# Altium schematic sheet SmartBriefBox.schdoc
size 218 x 139 mm
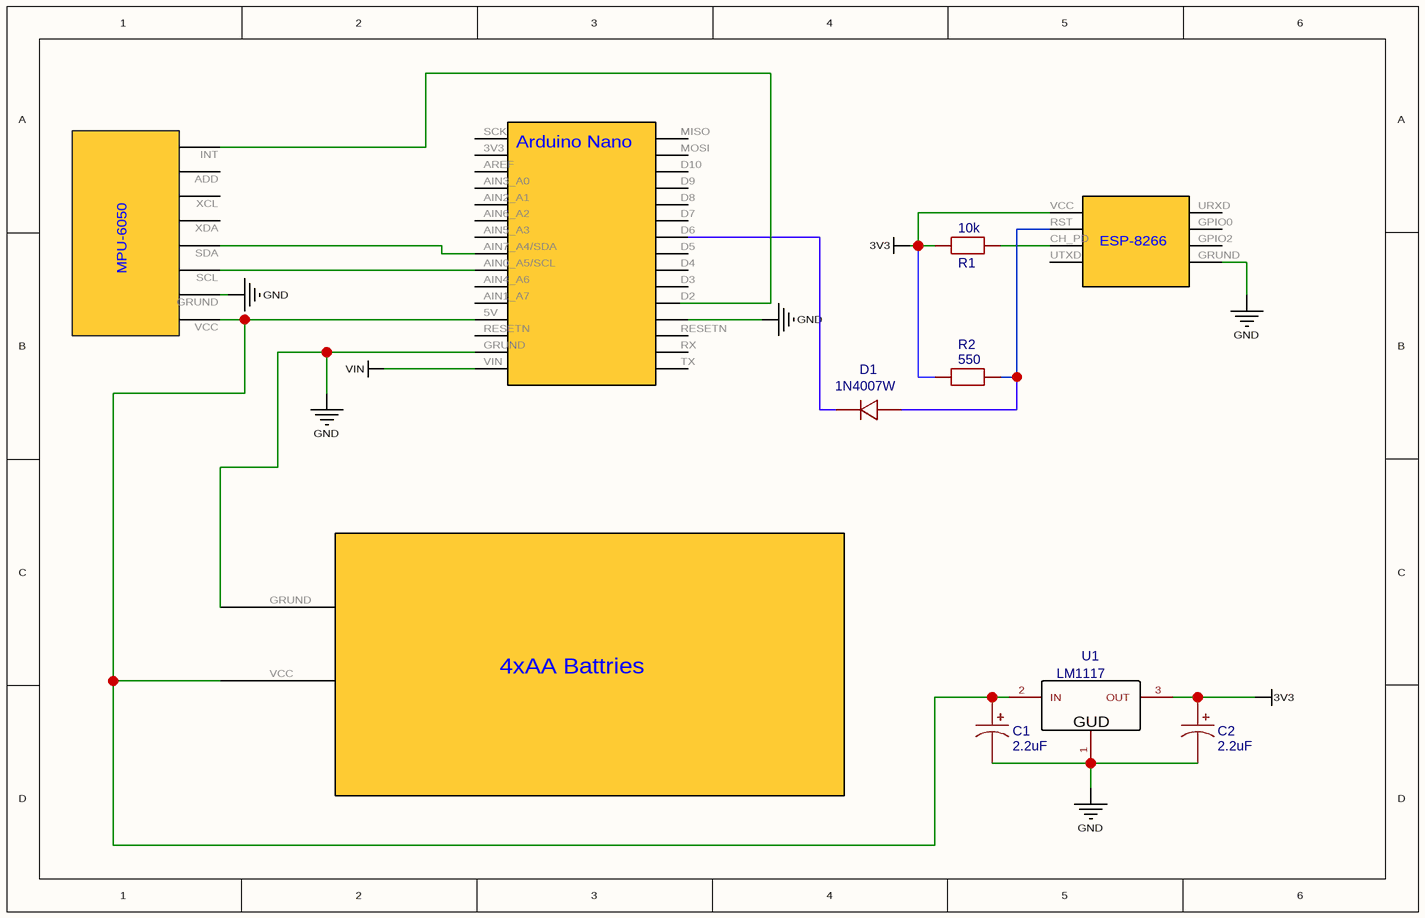
[diagram p0: SmartBriefBox.schdoc]

## Parts
C1  2.2uF  [CASE-A_3216]
C2  2.2uF  [CASE-A_3216]
D1  1N4007W  [SOD-123_L2.8-W1.8-LS3.7-RD]
R1  10k  [R0603]
R2  550  [R0603]
U1  LM1117  [TO-263-2_L10.1-W9.1-P5.08-LS15.2-BR]

## Nets
GRUND: C1.2 C2.2 U1.1(ADJ)  [also labelled GND]
VCC: C1.1 C2.1 R1.1 R2.1 U1.2(IN) U1.3(OUT)  [also labelled 3V3]
CH_PD: R1.2
RST: D1.2 R2.2

Not connected (* = marked no-connect by the designer): D1 1

## Notes on the sheet
- Arduino Nano
- MPU-6050
- ESP-8266
- 4xAA Battries
- Labels drawn without touching a wire or pin: 3V3, 5V, ADD, AIN0_A5/SCL, AIN1_A7, AIN2_A1, AIN3_A0, AIN4_A6, AIN5_A3, AIN6_A2, AIN7_A4/SDA, AREF, D3, D4, D5, D6, D7, D8, D9, D10, GPIO0, GPIO2, GRUND, MISO, MOSI, RESETN, RX, SCK, TX, URXD, UTXD, VCC, VIN, XCL, XDA
- (in symbol LM1117) GUD

## Library data of the parts
C1 C2 = 2.2uF: nameAlias: Value(F); Contributor: LCEDA_Lib; spicePre: C; spiceSymbolName: C_Tan_SMD_A_US
D1 = 1N4007W: BOM_Manufacturer: BLUE ROCKET; Contributor: LCEDA_Lib; BOM_Supplier: LCSC; BOM_Supplier Part: C328592; BOM_Manufacturer Part: 1N4007W; spicePre: D; spiceSymbolName: 1N4007W
R1 = 10k: nameAlias: Value(Ω); Contributor: LCEDA_Lib; spicePre: R; spiceSymbolName: R_0603_EU
R2 = 550: nameAlias: Value(Ω); Contributor: LCEDA_Lib; spicePre: R; spiceSymbolName: R_0603_EU
U1 = LM1117: BOM_Manufacturer: ON; BOM_Manufacturer Part: LM337D2TG; Contributor: LCEDA_Lib; BOM_Supplier: LCSC; BOM_Supplier Part: C146782; spicePre: U; spiceSymbolName: LM337(TO-263)